# EAGLE design BigLatchingRelayOnAStick-Electron (EAGLE 7.4.0)
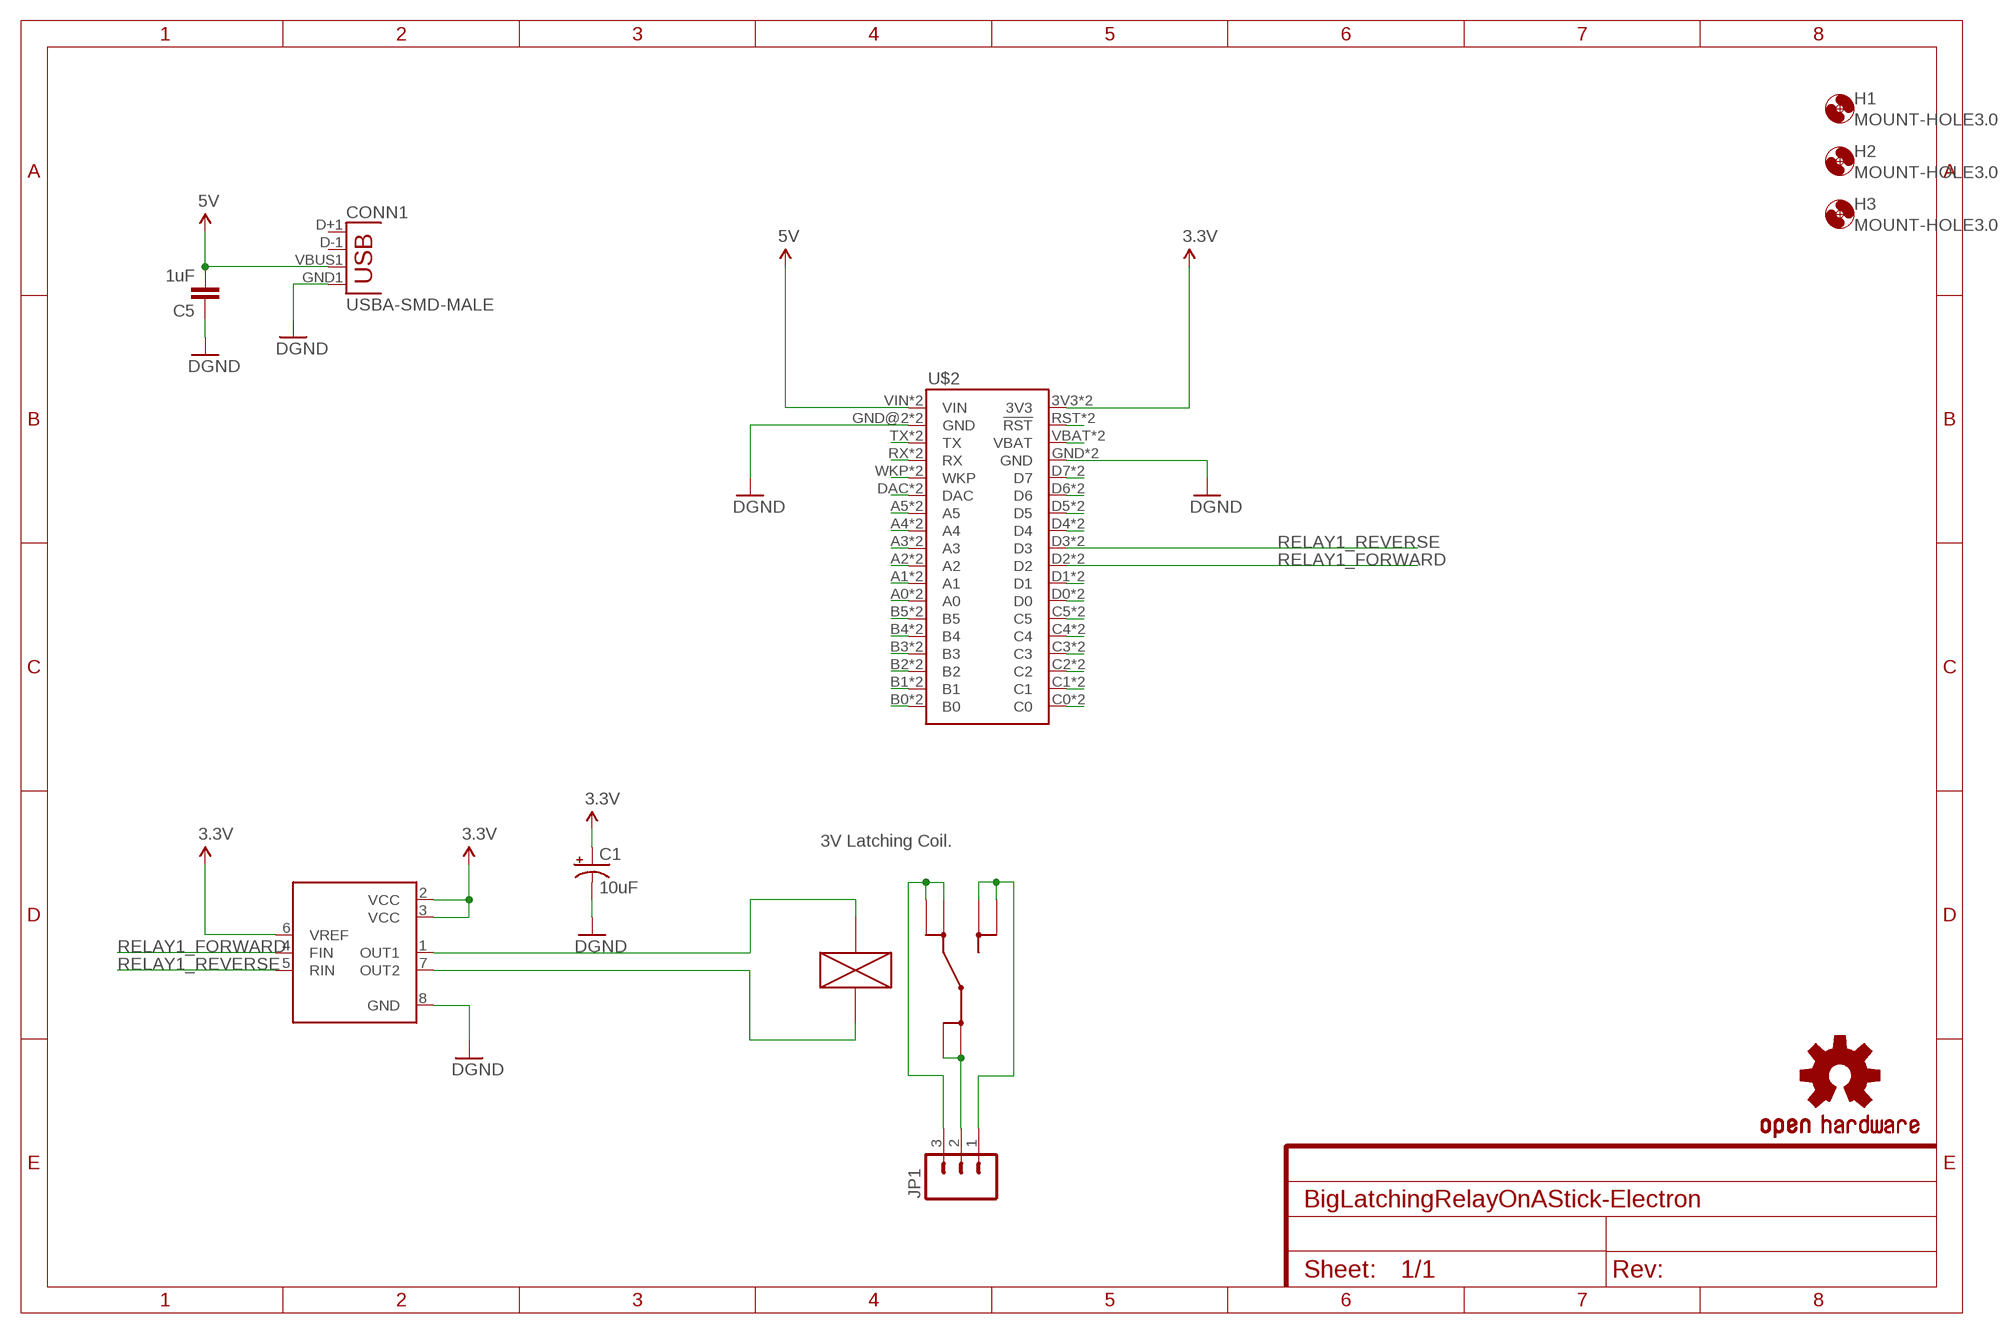
[diagram p0: schematic, sheet 1]

## Parts
C1  10uF  10UF-16V-10%(TANT)  [EIA3216]
C5  1uF  CAP0805  [0805]
CONN1  USBA-SMD-MALE  [USB-A-SMT-MALE]
H1  MOUNT-HOLE3.0  [3,0]
H2  MOUNT-HOLE3.0  [3,0]
H3  MOUNT-HOLE3.0  [3,0]
IC2  BD6211F  [SOP8]
JP1  M03-SCREW-5MM  [SCREWTERMINAL-5MM-3]
LOGO2  OSHW-LOGOS  [OSHW-LOGO-S]
U$1  RELAY_G5RL-1E  [G5RL-1E]
U$2  ELECTRONDUALNAMED  [ELECTRON_SIMPLE_SILK_NAMES_DUAL]

## Nets
3.3V: C1.A(+) IC2.2(VCC) IC2.3(VCC) IC2.6(VREF) U$2.3V3 U$2.3V3_1(3V3)
5V: C5.2 CONN1.VBUS1(VBUS) U$2.VIN U$2.VIN_1B(VIN)
GND: C1.C(-) C5.1 CONN1.GND1(GND) IC2.8(GND) U$2.GND U$2.GND@2(GND) U$2.GND_1(GND) U$2.GND_1B(GND) ; supply symbol labelled DGND
N$1: JP1.2 U$1.COM@1(COM) U$1.COM@2(COM)
N$3: JP1.1 U$1.NO@1(NO) U$1.NO@2(NO)
N$4: JP1.3 U$1.NC@1(NC) U$1.NC@2(NC)
N$6: U$2.VBAT U$2.VBATT_1(VBAT)
N$7: U$2.RST(!RST) U$2.RST_1(!RST)
N$11: U$2.D7 U$2.D7_1(D7)
N$12: IC2.1(OUT1) U$1.COIL+
N$13: IC2.7(OUT2) U$1.COIL-
N$15: U$2.D6 U$2.D6_1(D6)
N$16: U$2.D5 U$2.D5_1(D5)
N$20: U$2.D4 U$2.D4_1(D4)
N$21: U$2.D1 U$2.D1_1(D1)
N$22: U$2.D0 U$2.D0_1(D0)
N$23: U$2.C5 U$2.C5_1(C5)
N$24: U$2.C4 U$2.C4_1(C4)
N$25: U$2.C3 U$2.C3_1(C3)
N$26: U$2.C2 U$2.C2_1(C2)
N$28: U$2.C1 U$2.C1_1(C1)
N$29: U$2.C0 U$2.C0_1(C0)
N$31: U$2.B0 U$2.B0_1(B0)
N$33: U$2.B1 U$2.B1_1(B1)
N$35: U$2.B2 U$2.B2_1(B2)
N$36: U$2.B3 U$2.B3_1(B3)
N$37: U$2.B4 U$2.B4_1(B4)
N$38: U$2.B5 U$2.B5_1(B5)
N$39: U$2.A0 U$2.A0_1(A0)
N$40: U$2.A1 U$2.A1_1(A1)
N$41: U$2.A2 U$2.A2_1(A2)
N$42: U$2.A3 U$2.A3_1(A3)
N$43: U$2.A4 U$2.A4_1(A4)
N$44: U$2.A5 U$2.A5_1(A5)
N$45: U$2.DAC U$2.DAC_1(DAC)
N$46: U$2.WKP U$2.WKP_1(WKP)
N$47: U$2.RX U$2.RX_1(RX)
N$48: U$2.TX U$2.TX_1(TX)
RELAY1_FORWARD: IC2.4(FIN) U$2.D2 U$2.D2_1(D2)
RELAY1_REVERSE: IC2.5(RIN) U$2.D3 U$2.D3_1(D3)
Unconnected: CONN1.D+1(D+) CONN1.D-1(D-)

## Notes on the sheet
- 3V Latching Coil.

## Library data of the parts
C1 = SparkFun-Capacitors:10UF-16V-10%(TANT): CAP-00811 1206/EIA-3216 Tantalum capacitor; PROD_ID: CAP-00811
C5 = SparkFun-Passives:CAP: Capacitor Standard 0603 ceramic capacitor, and 0.1" leaded capacitor.
CONN1 = SparkFun-Connectors:USB: USB Connectors USB-B-PTH is fully proven SKU : PRT-00139/CONN-08278 USB-miniB is fully proven SKU : PRT-00587 USB-A-PCB is untested. USB-A-H is throughly reviewed, but untested. Spark Fun Electronics SKU : PRT-00437 USB-B-SMT is throughly reviewed, but untested. Needs silkscreen touching up. USB-A-S has not been used/tested USB-MB-H has not been used/tested USB-MICROB has been used. CONN-09505
H1-H3 = holes:MOUNT-HOLE: MOUNTING HOLE with drill center marker
IC2 = BD6211F:BD6211F
JP1 = SparkFun-Connectors:M03: Header 3 Standard 3-pin 0.1" header. Use with straight break away headers (SKU : PRT-00116), right angle break away headers (PRT-00553), swiss pins (PRT-00743), machine pins (PRT-00117), and female headers (PRT-00115). Molex polarized connector foot print use with SKU : PRT-08232 with associated crimp pins and housings.; STOREFRONT_ID: PRT-08433
LOGO2 = SparkFun-Aesthetics:OSHW-LOGO: Open Source Hardware Logo This logo indicates the piece of hardware it is found on incorporates a OSHW license and/or adheres to the definition of open source hardware found here: http://freedomdefined.org/OSHW
U$1 = RELAY_G5RL-1E:RELAY_G5RL-1E
U$2 = Tinamous:ELECTRON

## Board
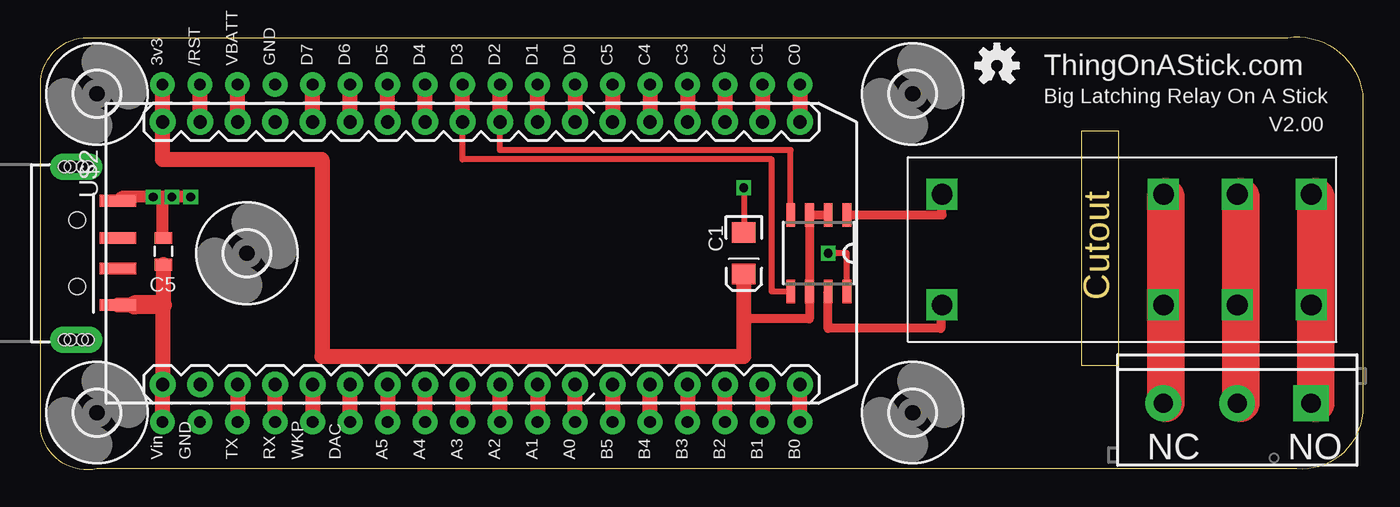
[diagram p1: board, top side]
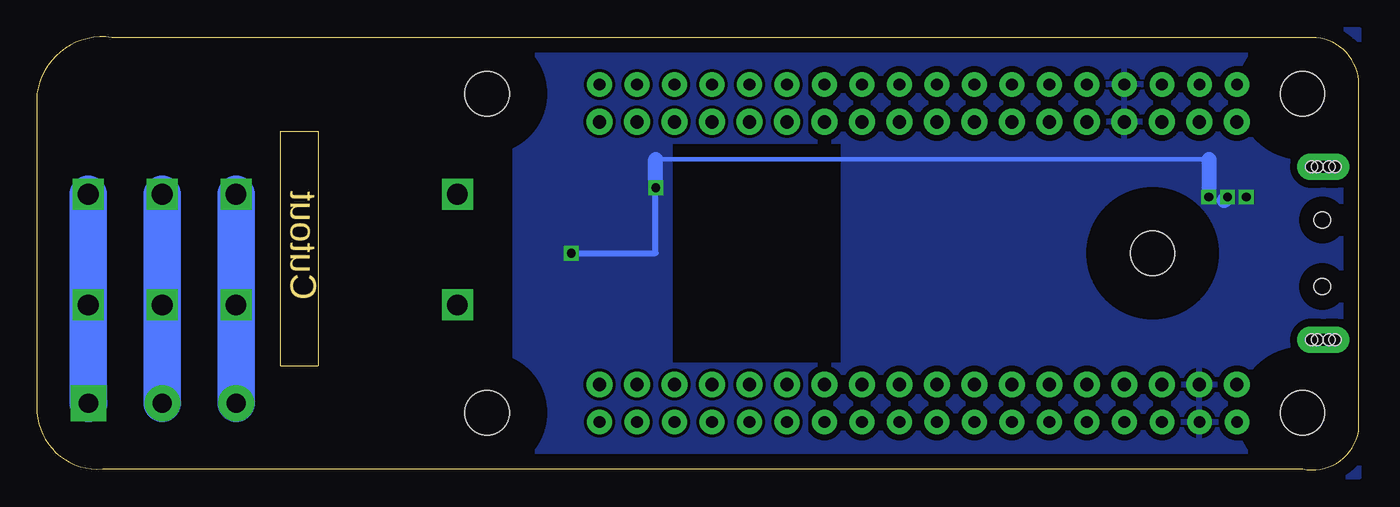
[diagram p2: board, bottom side, seen from below]

Size 89.54 x 29.31 mm. Coordinates in mm from the lower left corner, seen from the top.
Outline: 3.17,29.27 84.45,29.27 arc-90 89.54,25.46 89.54,3.87 arc-90 85.09,0.06 3.81,0.06 arc-90 0,2.6 0,26.1 arc-90 3.17,29.27
Outline: 70.48,22.92 70.48,7.05 73.03,7.05 73.03,22.92 70.48,22.92
Copper layers (1*16): Top 0.035mm / dielectric 1.5mm / Bottom 0.035mm
Design rules "default": minimum track width 10mil, minimum drill 24mil, track to track 8mil, track to pad 8mil, pad to pad 8mil, via to via 8mil, smd to smd 8mil, copper to edge 40mil, drill to drill 8mil, minimum pad ring 10mil, minimum via ring 8mil, stop-mask expansion 4mil, vias tented up to drill 0mil, thermal gap 10mil

### Footprints (pad centres in the part's own frame; a part is rotated, then mirrored left to right if it is on the bottom)
EIA3216 = smd 1.4 x 1.6: A 1.4,0; C -1.4,0
0805 = smd 0.8 x 1.2: 1 -0.9,0; 2 0.9,0
USB-A-SMT-MALE = smd 0.8 x 2.5: D+1 1.027,-5.87; D-1 -1.027,-5.87; GND1 3.551,-5.87; VBUS1 -3.5,-5.87 | drill 0.8 pad 1.778 long: P$1 5.85,-3.05; P$3 -5.85,-3.05 | hole 1.1: 2.25,-3.12; -2.25,-3.12 | hole 0.8: -5.85,-3.45; -5.85,-3.85; -5.85,-2.65; -5.85,-2.25; 5.85,-3.45; 5.85,-3.85; 5.85,-2.65; 5.85,-2.25
3,0 = hole 3: 0,0
SOP8 = smd 0.6 x 1.6: 1 -1.905,-2.6; 2 -0.635,-2.6; 3 0.635,-2.6; 4 1.905,-2.6; 5 1.905,2.6; 6 0.635,2.6; 7 -0.635,2.6; 8 -1.905,2.6
SCREWTERMINAL-5MM-3 = drill 1.3 pad 2.413 square: 1 0,0 | drill 1.3 pad 2.413: 2 5,0; 3 10,0
G5RL-1E = drill 1.4 square: COIL+ -10.7,4; COIL- -10.7,-3.5; COM@1 9.3,4; COM@2 9.3,-3.5; NC@1 4.3,4; NC@2 4.3,-3.5; NO@1 14.3,4; NO@2 14.3,-3.5
ELECTRON_SIMPLE_SILK_NAMES_DUAL = drill 0.889 pad 1.753: 3V3 1.27,22.86; A0 29.21,5.08; A1 26.67,5.08; A2 24.13,5.08; A3 21.59,5.08; A4 19.05,5.08; A5 16.51,5.08; B0 44.45,5.08; B1 41.91,5.08; B2 39.37,5.08; B3 36.83,5.08; B4 34.29,5.08; B5 31.75,5.08; C0 44.45,22.86; C1 41.91,22.86; C2 39.37,22.86; C3 36.83,22.86; C4 34.29,22.86; C5 31.75,22.86; D0 29.21,22.86; D1 26.67,22.86; D2 24.13,22.86; D3 21.59,22.86; D4 19.05,22.86; D5 16.51,22.86; D6 13.97,22.86; D7 11.43,22.86; DAC 13.97,5.08; GND 8.89,22.86; GND@2 3.81,5.08; RST 3.81,22.86; RX 8.89,5.08; TX 6.35,5.08; VBAT 6.35,22.86; VIN 1.27,5.08; WKP 11.43,5.08 | drill 0.8 pad 1.676: 3V3_1 1.27,25.4; A0_1 29.21,2.54; A1_1 26.67,2.54; A2_1 24.13,2.54; A3_1 21.59,2.54; A4_1 19.05,2.54; A5_1 16.51,2.54; B0_1 44.45,2.54; B1_1 41.91,2.54; B2_1 39.37,2.54; B3_1 36.83,2.54; B4_1 34.29,2.54; B5_1 31.75,2.54; C0_1 44.45,25.4; C1_1 41.91,25.4; C2_1 39.37,25.4; C3_1 36.83,25.4; C4_1 34.29,25.4; C5_1 31.75,25.4; D0_1 29.21,25.4; D1_1 26.67,25.4; D2_1 24.13,25.4; D3_1 21.59,25.4; D4_1 19.05,25.4; D5_1 16.51,25.4; D6_1 13.97,25.4; D7_1 11.43,25.4; DAC_1 13.97,2.54; GND_1 8.89,25.4; GND_1B 3.81,2.54; RST_1 3.81,25.4; RX_1 8.89,2.54; TX_1 6.35,2.54; VBATT_1 6.35,25.4; VIN_1B 1.27,2.54; WKP_1 11.43,2.54

### Placement (x,y rotation side)
C1  47.62,14.67 270 top
C5  8.32,14.79 270 top
CONN1  -0.63,14.67 90 top
H1  13.97,14.67 0 top
H2  59.05,25.46 0 top
H3  59.05,3.87 180 top
H4  MOUNT-HOLE3.0  [3,0]  3.81,25.46 0 top
H5  MOUNT-HOLE3.0  [3,0]  3.81,3.87 0 top
IC2  52.7,14.67 180 top
JP1  86.04,4.51 180 top
LOGO2  64.77,27.37 0 top
U$1  71.76,14.67 0 top
U$2  6.99,0.7 0 top

### Tracks (layer width: path | path; a pad name or v marks a point on that pad's centre or on a via)
3.3V
  Top 0.61: IC2.2 IC2.3 IC2.6 52.07,10.22 47.62,10.22 C1.A
  Top 1.016: C1.A 47.62,7.68 19.05,7.68 19.05,21.02 8.26,21.02 U$2.3V3 U$2.3V3_1
5V
  Top 0.813: C5.2 8.26,13.83
  Top 1.016: CONN1.VBUS1 6.35,11.17 6.67,11.17 | C5.2 8.32,11.17 8.26,11.17 U$2.VIN U$2.VIN_1B
  Top 1.27: 8.26,11.17 6.35,11.17
GND  (via drill 0.6)
  Top 0.406: IC2.8 54.61,14.67 v53.34,14.67 | v47.62,19.11 C1.C
  Top 0.813: v10.16,18.48 v8.89,18.48 8.26,18.48 | 8.26,18.48 v7.62,18.48 5.49,18.48 CONN1.GND1 | C5.1 8.26,15.76 8.26,18.48
  Bottom 0.305: 47.62,21.02 10.16,21.02
  Bottom 0.406: v53.34,14.67 47.62,14.67 v47.62,19.11
  Bottom 1.016: 9.14,18.22 v8.89,18.48 | v47.62,19.11 47.62,21.02 | 10.16,21.02 v10.16,18.48
  pour Bottom (isolate 0.406): 0,29.78 37.46,29.78 37.46,22.29 34.92,22.29 34.92,7.05 37.46,7.05 37.46,0.7 37.85,-0.45 0,-0.45
  pour Bottom: 37.46,29.91 57.15,29.91 57.15,0.06 37.46,0.06 37.46,7.05 46.67,7.05 46.67,22.29 37.46,22.29
N$1
  Bottom 2.54: JP1.2 81.06,4.51 U$1.COM@2 U$1.COM@1
N$3
  Bottom 2.54: JP1.1 86.06,4.51 U$1.NO@2 U$1.NO@1
N$4
  Bottom 2.54: JP1.3 76.06,4.51 U$1.NC@2 U$1.NC@1
N$6
  Top 1.016: U$2.VBAT U$2.VBATT_1
N$7
  Top 1.016: U$2.RST U$2.RST_1
N$11
  Top 1.016: U$2.D7 U$2.D7_1
N$12
  Top 0.61: IC2.1 61.05,17.27 U$1.COIL+
N$13
  Top 0.61: U$1.COIL- 60.96,11.17 60.96,9.59 53.34,9.59 IC2.7
N$15
  Top 1.016: U$2.D6 U$2.D6_1
N$16
  Top 1.016: U$2.D5 U$2.D5_1
N$19
  Top 2.54: 76.2,4.51 76.2,18.48
N$20
  Top 1.016: U$2.D4 U$2.D4_1
N$21
  Top 1.016: U$2.D1 U$2.D1_1
N$22
  Top 1.016: U$2.D0_1 U$2.D0
N$23
  Top 1.016: U$2.C5_1 U$2.C5
N$24
  Top 1.016: U$2.C4_1 U$2.C4
N$25
  Top 1.016: U$2.C3_1 U$2.C3
N$26
  Top 1.016: U$2.C2_1 U$2.C2
N$27
  Top 2.54: 81.28,4.51 81.28,18.48
N$28
  Top 1.016: U$2.C1_1 U$2.C1
N$29
  Top 1.016: U$2.C0_1 U$2.C0
N$30
  Top 2.54: 86.36,4.51 86.36,18.48
N$31
  Top 1.016: U$2.B0_1 U$2.B0
N$33
  Top 1.016: U$2.B1 U$2.B1_1
N$35
  Top 1.016: U$2.B2_1 U$2.B2
N$36
  Top 1.016: U$2.B3 U$2.B3_1
N$37
  Top 1.016: U$2.B4_1 U$2.B4
N$38
  Top 1.016: U$2.B5 U$2.B5_1
N$39
  Top 1.016: U$2.A0_1 U$2.A0
N$40
  Top 1.016: U$2.A1 U$2.A1_1
N$41
  Top 1.016: U$2.A2_1 U$2.A2
N$42
  Top 1.016: U$2.A3 U$2.A3_1
N$43
  Top 1.016: U$2.A4_1 U$2.A4
N$44
  Top 1.016: U$2.A5 U$2.A5_1
N$45
  Top 1.016: U$2.DAC_1 U$2.DAC
N$46
  Top 1.016: U$2.WKP U$2.WKP_1
N$47
  Top 1.016: U$2.RX_1 U$2.RX
N$48
  Top 1.016: U$2.TX U$2.TX_1
RELAY1_FORWARD
  Top 0.406: IC2.4 50.8,21.65 31.11,21.65 U$2.D2
  Top 1.016: U$2.D2 U$2.D2_1
RELAY1_REVERSE
  Top 0.406: IC2.5 49.53,12.07 49.53,21.02 28.57,21.02 U$2.D3
  Top 1.016: U$2.D3 U$2.D3_1

### Text on the board
Dimension: Cutout
tNames: ThingOnAStick.com | Big Latching Relay On A Stick | V2.00 | NC | NO